# EAGLE design LC4032V-CPLDbreakout-v1 (EAGLE 5.11)
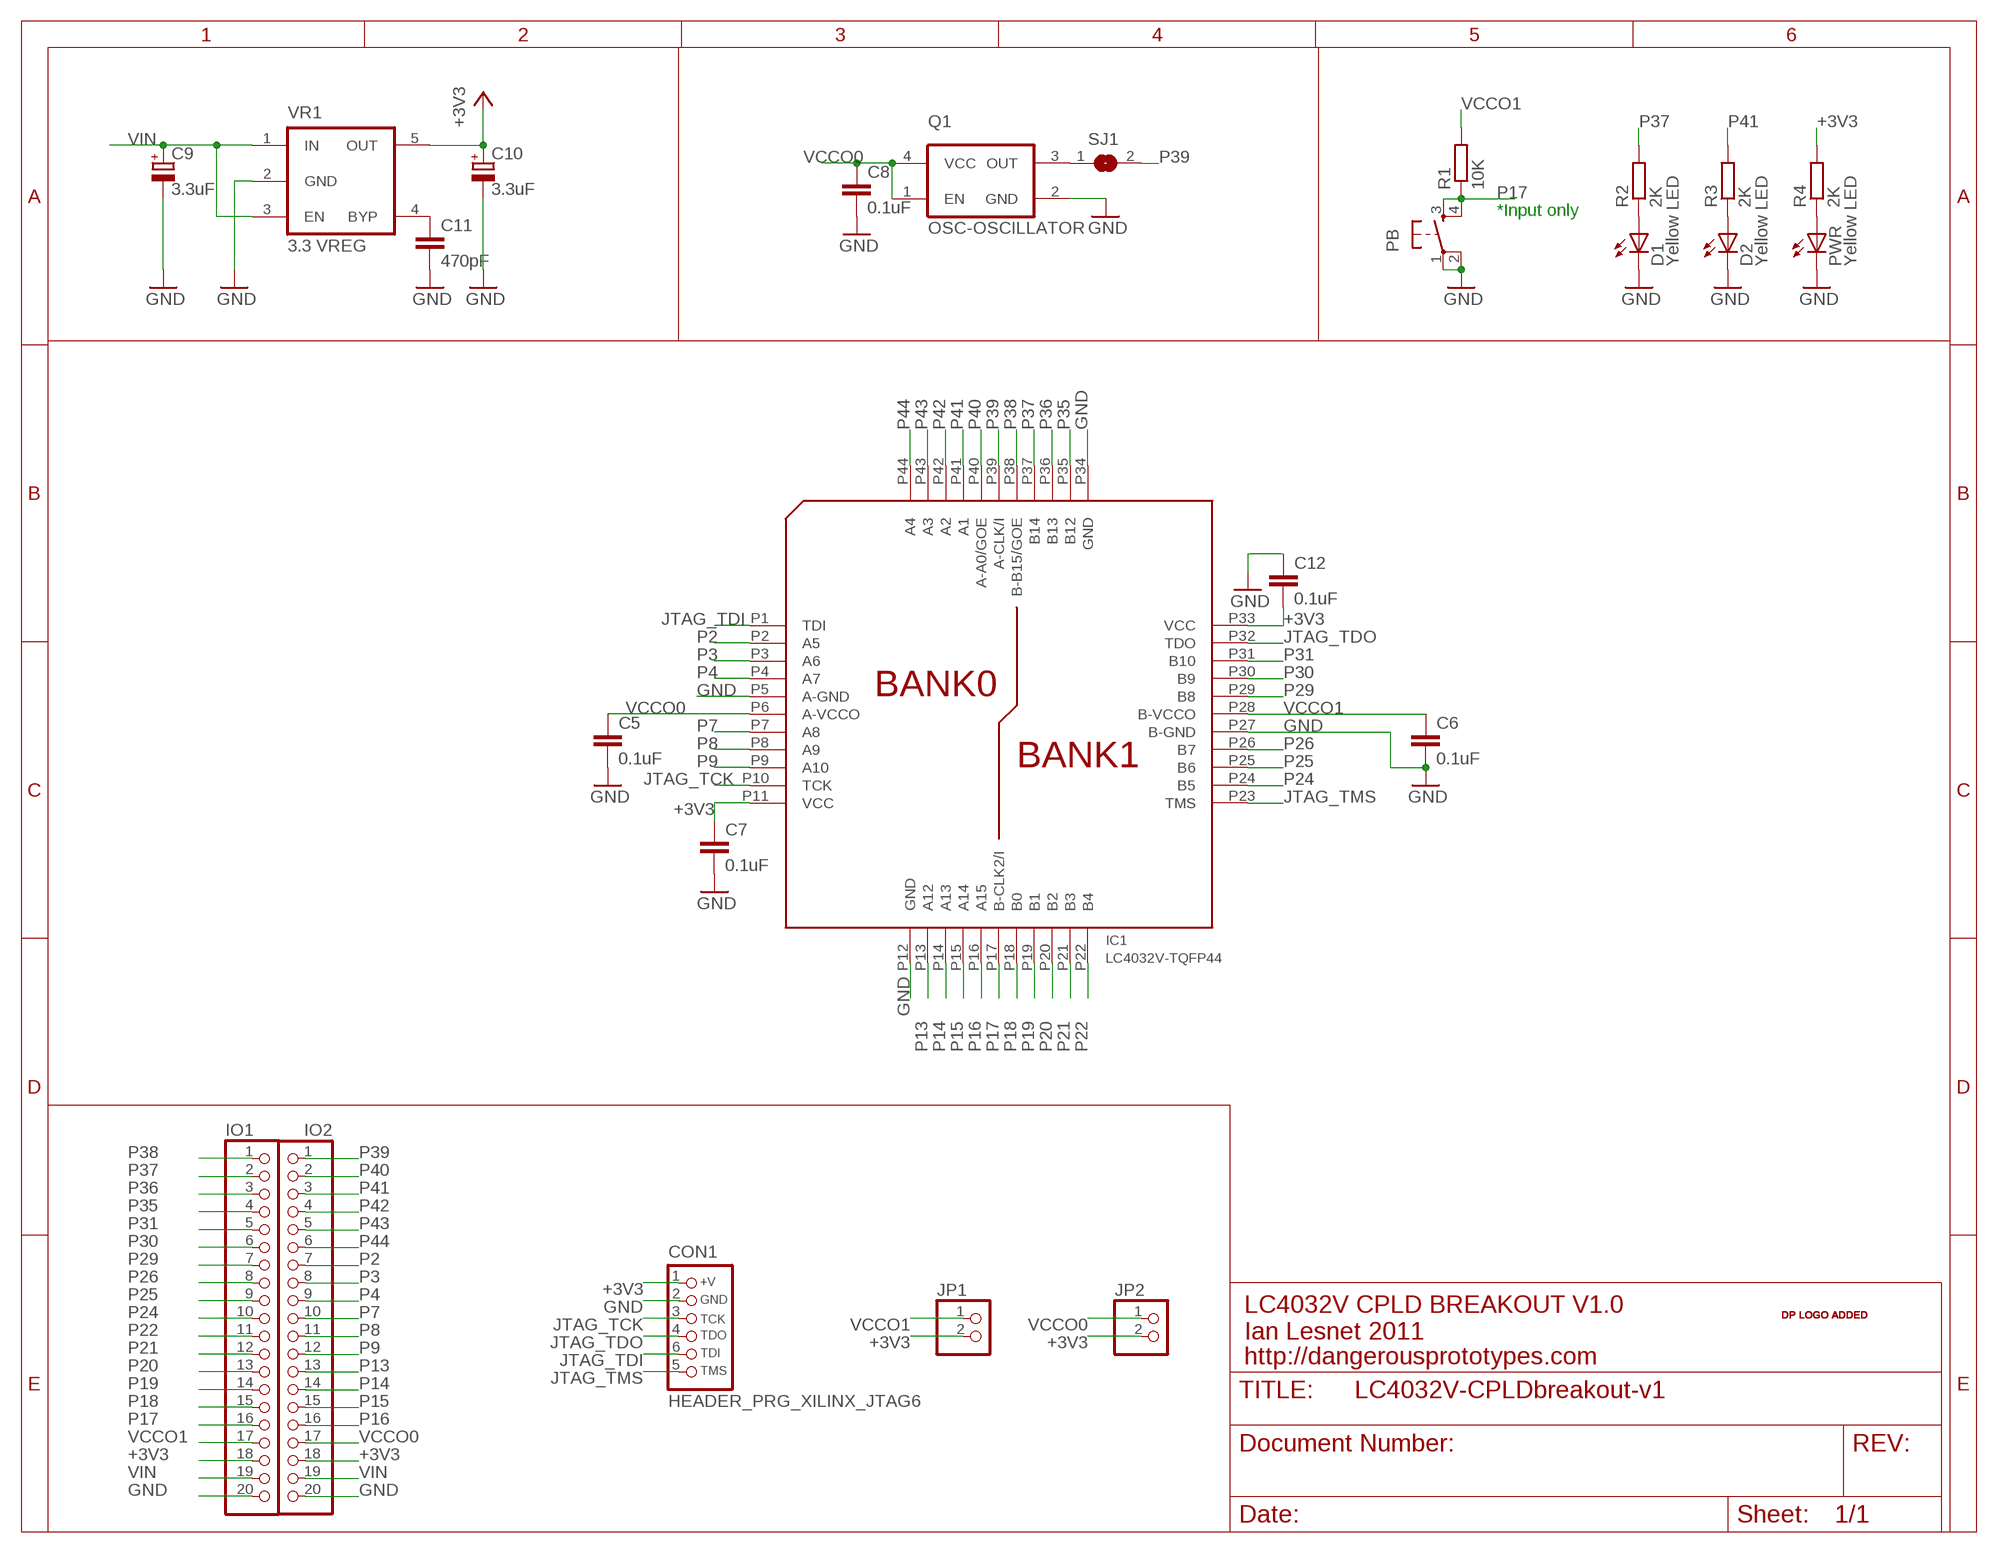
[diagram p0: schematic, sheet 1]

## Parts
C5  0.1uF  CAPC603  [C603]
C6  0.1uF  CAPC603  [C603]
C7  0.1uF  CAPC603  [C603]
C8  0.1uF  CAPC603  [C603]
C9  3.3uF  CAP_POLSMC_A  [SMC_A]
C10  3.3uF  CAP_POLSMC_A  [SMC_A]
C11  470pF  CAPC603  [C603]
C12  0.1uF  CAPC603  [C603]
CON1  HEADER_PRG_XILINX_JTAG6  [HEADER_PRG_1X06]
D1  Yellow LED  LED805  [LED-805]
D2  Yellow LED  LED805  [LED-805]
IC1  LC4032V-TQFP44  [TQFP44]
IO1  PINHD-1X20  [1X20]
IO2  PINHD-1X20  [1X20]
JP1  PINHD-1X02_2.54-S  [1X02-S]
JP2  PINHD-1X02_2.54-S  [1X02-S]
PB  SMD button small  SMD_TACT_SMALL  [TACT_SWITCH_SMALL]
PWR  Yellow LED  LED805  [LED-805]
Q1  OSC-OSCILLATOR  [OSCILLATOR_7X5_SMD]
R1  10K  RESISTORR603  [R603]
R2  2K  RESISTORR603  [R603]
R3  2K  RESISTORR603  [R603]
R4  2K  RESISTORR603  [R603]
SJ1  SJ  [SJ]
U$1  DP_LOGO  [DP_LOGO]
VR1  3.3 VREG  MIC5205  [SOT-23-5]

## Nets
+3V3: C7.1 C10.+ C12.2 CON1.1(+V) IC1.P11(VCC) IC1.P33(VCC) IO1.18 IO2.18 JP1.2 JP2.2 R4.2 VR1.5(OUT)
GND: C5.2 C6.2 C7.2 C8.2 C9.- C10.- C11.2 C12.1 CON1.2(GND) D1.C D2.C IC1.P5(A-GND) IC1.P12(GND) IC1.P27(B-GND) IC1.P34(GND) IO1.20 IO2.20 PB.1 PB.2 PWR.C Q1.2(GND) VR1.2(GND)
JTAG_TCK: CON1.3(TCK) IC1.P10(TCK)
JTAG_TDI: CON1.6(TDI) IC1.P1(TDI)
JTAG_TDO: CON1.4(TDO) IC1.P32(TDO)
JTAG_TMS: CON1.5(TMS) IC1.P23(TMS)
N$1: D1.A R2.1
N$2: D2.A R3.1
N$3: PWR.A R4.1
N$5: Q1.3(OUT) SJ1.1
N$7: C11.1 VR1.4(BYP)
P2: IC1.P2(A5) IO2.7
P3: IC1.P3(A6) IO2.8
P4: IC1.P4(A7) IO2.9
P7: IC1.P7(A8) IO2.10
P8: IC1.P8(A9) IO2.11
P9: IC1.P9(A10) IO2.12
P13: IC1.P13(A12) IO2.13
P14: IC1.P14(A13) IO2.14
P15: IC1.P15(A14) IO2.15
P16: IC1.P16(A15) IO2.16
P17: IC1.P17(B-CLK2/I) IO1.16 PB.3 PB.4 R1.1
P18: IC1.P18(B0) IO1.15
P19: IC1.P19(B1) IO1.14
P20: IC1.P20(B2) IO1.13
P21: IC1.P21(B3) IO1.12
P22: IC1.P22(B4) IO1.11
P24: IC1.P24(B5) IO1.10
P25: IC1.P25(B6) IO1.9
P26: IC1.P26(B7) IO1.8
P29: IC1.P29(B8) IO1.7
P30: IC1.P30(B9) IO1.6
P31: IC1.P31(B10) IO1.5
P35: IC1.P35(B12) IO1.4
P36: IC1.P36(B13) IO1.3
P37: IC1.P37(B14) IO1.2 R2.2
P38: IC1.P38(B-B15/GOE) IO1.1
P39: IC1.P39(A-CLK/I) IO2.1 SJ1.2
P40: IC1.P40(A-A0/GOE) IO2.2
P41: IC1.P41(A1) IO2.3 R3.2
P42: IC1.P42(A2) IO2.4
P43: IC1.P43(A3) IO2.5
P44: IC1.P44(A4) IO2.6
VCCO0: C5.1 C8.1 IC1.P6(A-VCCO) IO2.17 JP2.1 Q1.1(EN) Q1.4(VCC)
VCCO1: C6.1 IC1.P28(B-VCCO) IO1.17 JP1.1 R1.2
VIN: C9.+ IO1.19 IO2.19 VR1.1(IN) VR1.3(EN)

## Notes on the sheet
- *Input only
- LC4032V CPLD BREAKOUT V1.0
- Ian Lesnet 2011
- http://dangerousprototypes.com

## Library data of the parts
C5-C8 C11 C12 = dp_devices:CAP
C9 C10 = dp_devices:CAP_POL
CON1 = dp_devices:HEADER_PRG_XILINX_JTAG6: 6-pin Xilinx JTAG programming header
D1 D2 PWR = dp_devices:LED
IC1 = dp_devices:LC4032V: 32 Macrocells 3.3V CPLD
IO1 IO2 = pinhead:PINHD-1X20: PIN HEADER
JP1 JP2 = pinhead-2:PINHD-1X02: PIN HEADER
PB = dp_devices:SMD_TACT_SMALL
Q1 = dp_devices:OSC-OSCILLATOR: Oscillator
R1-R4 = dp_devices:RESISTOR
SJ1 = jumper:SJ: SMD solder JUMPER
U$1 = dp_devices:DP_LOGO; FF1: fullfillment by; FF2: Seeed studio; FF3: www.seeedstudio.com; LICENSE: CC-BY-SA; PROJECT: project; URL1: http://; URL2: DangerousPrototypes.com
VR1 = dp_devices:MIC5205: 150ma Low-Noise LDO Regulator

## Board
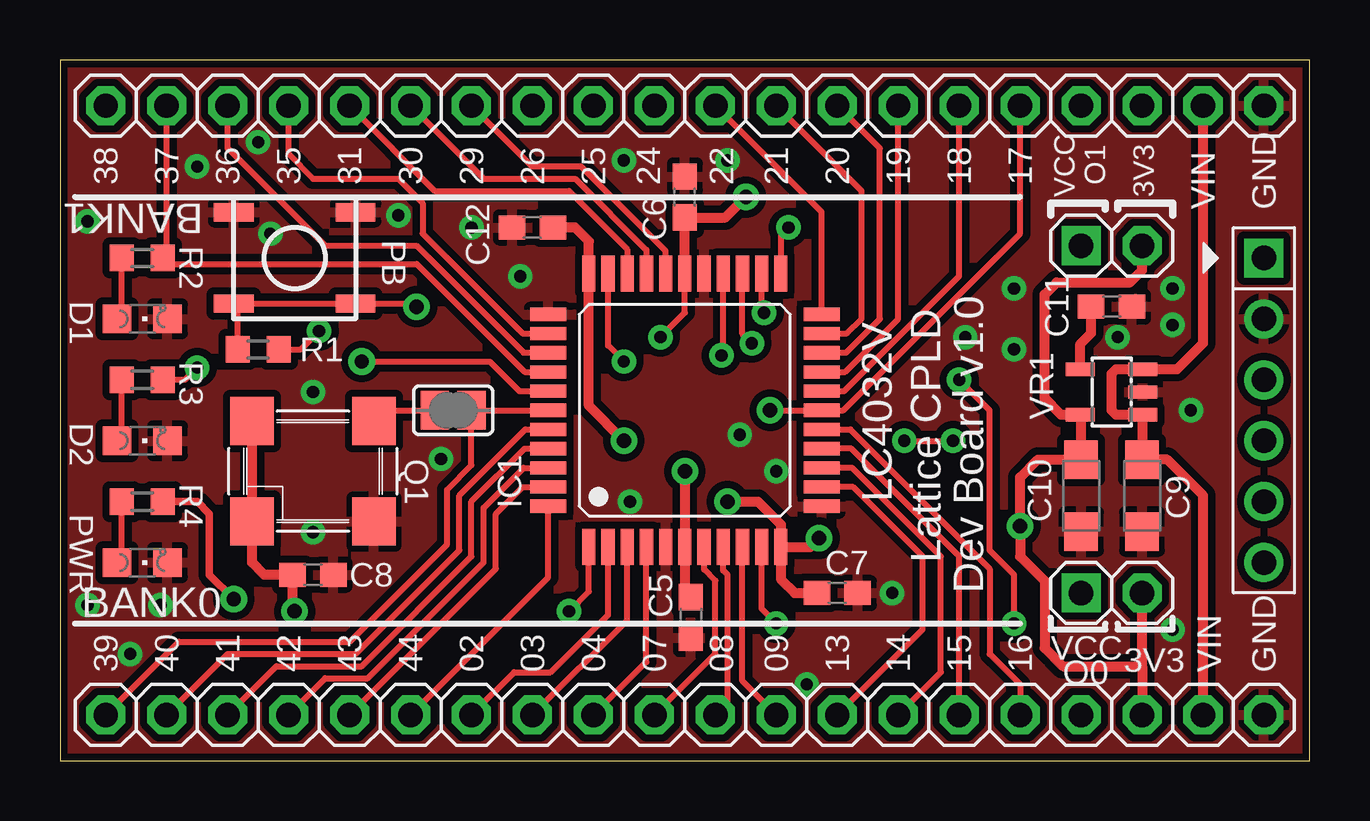
[diagram p1: board, top side]
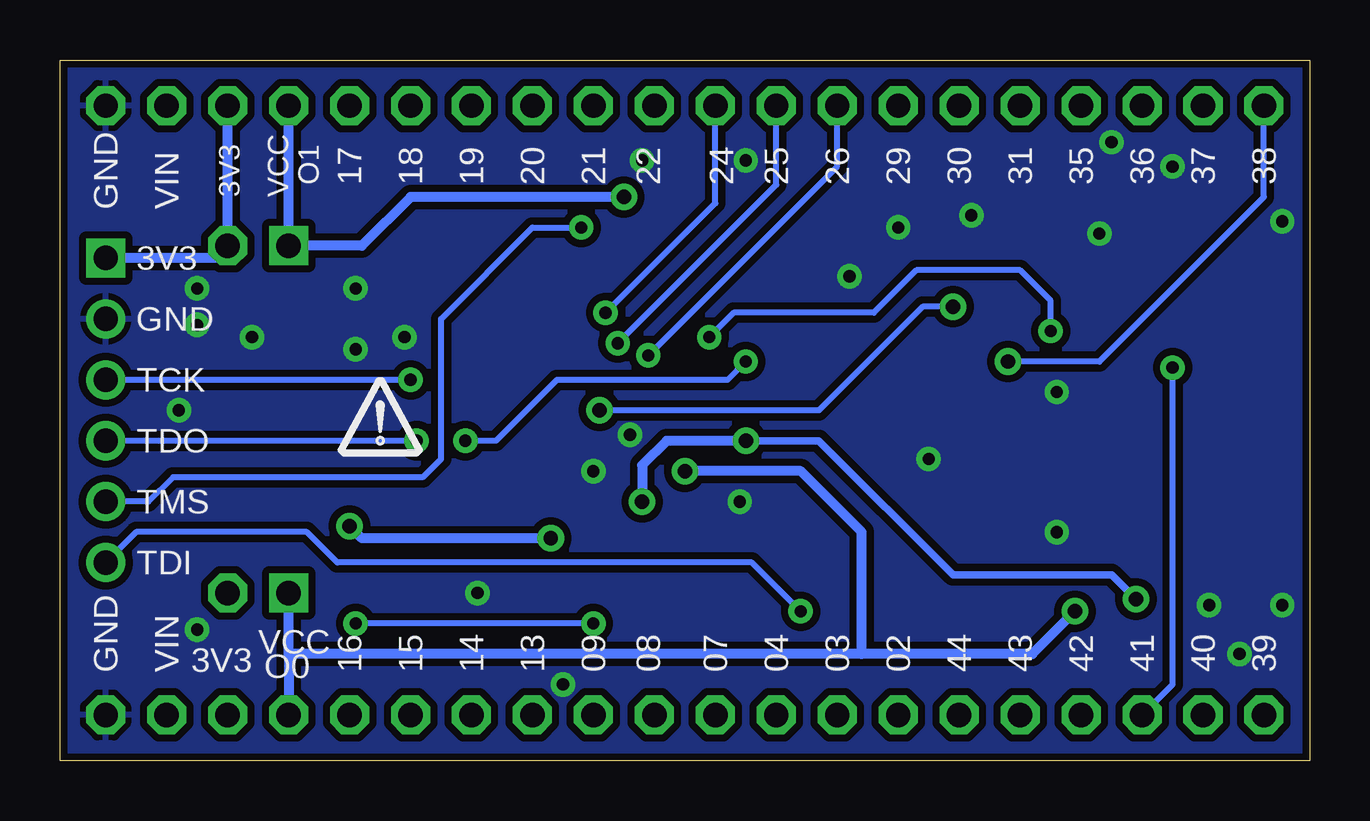
[diagram p2: board, bottom side, seen from below]

Size 52.07 x 29.21 mm. Coordinates in mm from the lower left corner, seen from the top.
Outline: 0,0 52.07,0 52.07,29.21 0,29.21 0,0
Copper layers (1*16): Top 0.035mm / dielectric 1.5mm / Bottom 0.035mm
Design rules "SparkFun": minimum track width 8mil, minimum drill 20mil, track to track 8mil, track to pad 8mil, pad to pad 8mil, via to via 8mil, smd to smd 8mil, copper to edge 10mil, drill to drill 8mil, minimum pad ring 12mil, minimum via ring 10mil, stop-mask expansion 4mil, vias tented up to drill 25mil, thermal gap 10mil

### Footprints (pad centres in the part's own frame; a part is rotated, then mirrored left to right if it is on the bottom)
C603 = smd 1.1 x 1: 1 -0.85,0; 2 0.85,0
SMC_A = smd 1.6 x 1.4: + -1.5,0; - 1.5,0
HEADER_PRG_1X06 = drill 1.016 square: 1 -6.35,0 | drill 1.016 round: 2 -3.81,0; 3 -1.27,0; 4 1.27,0; 5 3.81,0; 6 6.35,0
LED-805 = smd 1.2 x 1.2: A 0,-1.05; C 0,1.05
TQFP44 = smd 0.55 x 1.5: P1 -4,-5.7; P2 -3.2,-5.7; P3 -2.4,-5.7; P4 -1.6,-5.7; P5 -0.8,-5.7; P6 0,-5.7; P7 0.8,-5.7; P8 1.6,-5.7; P9 2.4,-5.7; P10 3.2,-5.7; P11 4,-5.7; P23 4,5.7; P24 3.2,5.7; P25 2.4,5.7; P26 1.6,5.7; P27 0.8,5.7; P28 0,5.7; P29 -0.8,5.7; P30 -1.6,5.7; P31 -2.4,5.7; P32 -3.2,5.7; P33 -4,5.7 | smd 1.5 x 0.55: P12 5.7,-4; P13 5.7,-3.2; P14 5.7,-2.4; P15 5.7,-1.6; P16 5.7,-0.8; P17 5.7,0; P18 5.7,0.8; P19 5.7,1.6; P20 5.7,2.4; P21 5.7,3.2; P22 5.7,4; P34 -5.7,4; P35 -5.7,3.2; P36 -5.7,2.4; P37 -5.7,1.6; P38 -5.7,0.8; P39 -5.7,0; P40 -5.7,-0.8; P41 -5.7,-1.6; P42 -5.7,-2.4; P43 -5.7,-3.2; P44 -5.7,-4
1X20 = drill 1.016 octagon: 1 -24.13,0; 2 -21.59,0; 3 -19.05,0; 4 -16.51,0; 5 -13.97,0; 6 -11.43,0; 7 -8.89,0; 8 -6.35,0; 9 -3.81,0; 10 -1.27,0; 11 1.27,0; 12 3.81,0; 13 6.35,0; 14 8.89,0; 15 11.43,0; 16 13.97,0; 17 16.51,0; 18 19.05,0; 19 21.59,0; 20 24.13,0
1X02-S = drill 1.016 square: 1 -1.27,0 | drill 1.016 octagon: 2 1.27,0
TACT_SWITCH_SMALL = smd 1.651 x 0.762: 1 -2.54,1.905; 2 2.54,1.905; 3 -2.54,-1.905; 4 2.54,-1.905
OSCILLATOR_7X5_SMD = smd 1.8 x 2: 1 -2.54,-2.1; 2 2.54,-2.1; 3 2.54,2.1; 4 -2.54,2.1
R603 = smd 1 x 1.1: 1 -0.85,0; 2 0.85,0
SJ = smd 1.168 x 1.6: 1 -0.762,0; 2 0.762,0
SOT-23-5 = smd 0.55 x 1.2: 1 -0.95,-1.3; 2 0,-1.3; 3 0.95,-1.3; 4 0.95,1.3; 5 -0.95,1.3

### Placement (x,y rotation side)
C5  26.29,5.97 270 top
C6  26.04,23.49 90 top
C7  32.39,6.99 0 top
C8  10.54,7.75 0 top
C9  45.09,11.05 270 top
C10  42.55,11.05 270 top
C11  43.82,18.92 0 top
C12  19.68,22.22 0 top
CON1  50.16,14.61 270 top
D1  3.43,18.41 270 top
D2  3.43,13.34 270 top
IC1  26.04,14.61 0 top
IO1  26.04,27.3 0 top
IO2  26.04,1.91 0 top
JP1  43.82,21.46 0 top
JP2  43.82,6.99 0 top
PB  9.78,20.95 0 top
PWR  3.43,8.26 270 top
Q1  10.54,12.06 0 top
R1  8.26,17.14 0 top
R2  3.43,20.95 0 top
R3  3.43,15.88 0 top
R4  3.43,10.79 0 top
SJ1  16.38,14.61 0 top
U$1  38.73,13.34 0 bottom
VR1  43.82,15.37 90 top

### Tracks (layer width: path | path; a pad name or v marks a point on that pad's centre or on a via)
+3V3  (via drill 0.6)
  Top 0.305: R4.2 5.71,10.79 6.22,10.29 6.22,7.75 v7.24,6.73
  Top 0.406: C12.2 21.46,22.22 22.04,21.65 IC1.P33 22.04,14.79 v23.49,13.34 | IC1.P11 30.04,7.56 30.61,6.99 C7.1 | JP1.2 45.09,20.45 44.58,19.94 41.53,19.94 41.02,19.43 41.02,15.11 41.72,14.42 VR1.5 42.55,14.39 C10.+ 40.74,12.55 40.01,11.81 v40.01,9.78 40.01,8.51 41.02,7.49 41.02,4.7 41.78,3.94 45.09,3.94 | IC1.P11 31.26,8.9 v31.62,9.27 | IC1.P11 30.04,9.84 29.08,10.79 v27.81,10.79 | 45.09,3.94 IO2.18 | 45.09,3.94 JP2.2
  Bottom 0.305: v23.49,13.34 20.45,13.34 14.86,7.75 8.26,7.75 v7.24,6.73
  Bottom 0.406: CON1.1 45.59,20.95 JP1.2 IO1.18 | v31.62,9.27 39.5,9.27 v40.01,9.78 | v23.49,13.34 26.8,13.34 27.81,12.32 v27.81,10.79
GND  (via drill 0.51)
  other vias: 17.14,22.22 19.18,20.19 8.76,21.97 5.71,24.76 8.26,25.78 14.1,22.73 1.14,22.48 2.92,4.45 4.19,6.48 1.14,6.48 15.88,12.57 10.54,15.37 10.54,9.53 28.32,13.59 29.84,12.06 23.75,10.79 27.81,25.02 23.49,25.02 46.36,19.68 44.07,17.65 46.36,18.16 47.12,14.61 46.36,5.46 31.11,3.17 34.67,6.99 39.75,19.68 39.75,17.14 37.72,17.65
  pour Bottom (isolate 0.305): -0.64,-0.64 52.71,-0.64 52.71,29.84 -0.64,29.84
  pour Top (isolate 0.305): -0.64,-0.64 52.71,-0.64 52.71,29.84 -0.64,29.84
JTAG_TCK  (via drill 0.51)
  Top 0.254: v29.84,5.71 29.23,6.33 IC1.P10 | v37.47,15.88 38.73,14.61 38.73,8.76 39.75,7.75 v39.75,5.71
  Bottom 0.254: v37.47,15.88 CON1.3 | v29.84,5.71 v39.75,5.71
JTAG_TDI  (via drill 0.51)
  Top 0.254: IC1.P1 22.04,7.05 v21.21,6.22
  Bottom 0.254: v21.21,6.22 23.24,8.26 40.51,8.26 41.78,9.53 48.9,9.53 CON1.6
JTAG_TDO  (via drill 0.51)
  Top 0.254: v35.18,13.34 v37.21,13.34 | v23.49,16.64 22.83,17.3 IC1.P32
  Bottom 0.254: v37.21,13.34 CON1.4 | v35.18,13.34 33.91,13.34 31.37,15.88 24.26,15.88 v23.49,16.64
JTAG_TMS  (via drill 0.51)
  Top 0.254: v30.35,22.22 30.04,21.91 IC1.P23
  Bottom 0.254: v30.35,22.22 32.39,22.22 36.2,18.41 36.2,12.57 36.96,11.81 47.37,11.81 48.39,10.79 CON1.5
N$1
  Top 0.254: R2.1 2.58,18.61 D1.A
N$2
  Top 0.254: R3.1 2.58,13.54 D2.A
N$3
  Top 0.254: R4.1 2.58,8.46 PWR.A
N$5
  Top 0.254: SJ1.1 12.51,14.61 Q1.3
N$7
  Top 0.406: VR1.4 42.52,17.37 42.97,17.82 C11.1
P2
  Top 0.254: IC1.P2 22.83,6.07 20.45,3.68 18.92,3.68 IO2.7
P3
  Top 0.254: IC1.P3 23.63,5.86 IO2.8
P4
  Top 0.254: IC1.P4 24.43,4.12 IO2.9
P7
  Top 0.254: IC1.P7 26.83,7.96 27.3,7.49 27.3,4.45 IO2.10
P8
  Top 0.254: 27.63,2.24 IO2.11 27.81,2.41 27.81,7.75 27.63,7.93 IC1.P8
P9
  Top 0.254: IC1.P9 28.43,3.32 IO2.12
P13
  Top 0.254: IC1.P13 33.05,11.4 35.94,8.51 35.94,5.46 IO2.13
P14
  Top 0.254: IC1.P14 33.01,12.21 36.7,8.51 36.7,3.68 IO2.14
P15
  Top 0.254: IC1.P15 32.97,13.01 37.47,8.51 IO2.15
P16
  Top 0.254: IC1.P16 32.93,13.8 38.73,8 38.73,4.45 40.01,3.17 IO2.16
P17  (via drill 0.6)
  Top 0.254: PB.3 PB.4 14.73,19.05 v14.86,18.92 | v29.59,14.61 IC1.P17 32.64,14.61 40.01,21.97 IO1.16 | PB.3 7.24,18.8 | R1.1 7.4,18.63 PB.3
  Bottom 0.254: v29.59,14.61 20.45,14.61 16.13,18.92 v14.86,18.92
P18
  Top 0.254: IC1.P18 32.68,15.4 37.47,20.19 IO1.15
P19
  Top 0.254: IC1.P19 32.72,16.2 34.93,18.41 IO1.14
P20
  Top 0.254: IC1.P20 32.75,17 34.16,18.41 34.16,25.53 IO1.13
P21
  Top 0.254: IC1.P21 32.79,17.8 33.4,18.41 33.4,23.75 IO1.12
P22
  Top 0.254: IC1.P22 31.73,22.88 IO1.11
P24  (via drill 0.51)
  Top 0.254: IC1.P24 29.23,18.77 v29.34,18.67
  Bottom 0.254: IO1.10 24.76,23.24 v29.34,18.67
P25  (via drill 0.51)
  Top 0.254: IC1.P25 28.43,17.79 v28.83,17.4
  Bottom 0.254: v28.83,17.4 22.22,24 IO1.9
P26  (via drill 0.51)
  Top 0.254: IC1.P26 27.63,17.07 v27.56,16.89
  Bottom 0.254: IO1.8 19.68,24.76 v27.56,16.89
P29
  Top 0.254: IC1.P29 25.23,21.25 21.72,24.76 19.68,24.76 IO1.7
P30
  Top 0.254: IC1.P30 24.43,21.29 21.46,24.26 17.65,24.26 IO1.6
P31
  Top 0.254: IC1.P31 23.63,21.32 21.21,23.75 15.62,23.75 IO1.5
P35
  Top 0.254: IC1.P35 19.28,17.8 15.11,21.97 15.11,23.24 14.1,24.26 10.54,24.26 9.53,25.27 IO1.4
P36
  Top 0.254: IC1.P36 19.32,17 14.86,21.46 11.05,21.46 6.99,25.53 IO1.3
P37
  Top 0.254: IO1.2 4.45,21.21 4.28,21.04 R2.2 4.28,20.7 14.86,20.7 19.35,16.2 IC1.P37
P38  (via drill 0.6)
  Top 0.254: IC1.P38 19.14,15.4 17.91,16.64 v12.57,16.64
  Bottom 0.254: v12.57,16.64 8.76,16.64 1.91,23.49 IO1.1
P39
  Top 0.254: IC1.P39 SJ1.2 17.14,12.32 16.13,11.3 16.13,9.02 12.06,4.95 4.95,4.95 IO2.1
P40
  Top 0.254: IC1.P40 19.39,13.8 16.64,11.05 16.64,8.76 12.32,4.45 6.99,4.45 IO2.2
P41  (via drill 0.51)
  Top 0.254: IC1.P41 19.35,13.01 17.14,10.79 17.14,8.51 12.57,3.94 9.02,3.94 IO2.3 | R3.2 5.21,15.88 v5.71,16.38
  Bottom 0.254: v5.71,16.38 5.71,3.17 IO2.3
P42
  Top 0.254: IC1.P42 19.32,12.21 17.65,10.54 17.65,8.26 12.83,3.43 11.05,3.43 IO2.4
P43
  Top 0.254: IC1.P43 19.28,11.4 18.16,10.29 18.16,8 IO2.5
P44
  Top 0.254: IC1.P44 20.33,7.63 IO2.6
VCCO0  (via drill 0.6)
  Top 0.406: C5.1 26.04,7.07 IC1.P6 v26.04,12.06 | Q1.4 Q1.1 8,8.26 8.51,7.75 C8.1 9.69,6.31 v9.78,6.22
  Bottom 0.406: 18.67,4.45 11.56,4.45 v9.78,6.22 | v26.04,12.06 21.21,12.06 18.67,9.53 18.67,4.45 | 42.55,4.45 IO2.17 | 42.55,4.45 JP2.1 | 18.67,4.45 42.55,4.45
VCCO1  (via drill 0.51, 0.6)
  Top 0.254: IC1.P28 26.04,18.67 v25.02,17.65 | R1.2 10.03,17.14 v10.79,17.91
  Top 0.406: IC1.P28 C6.1 27.72,22.64 v28.57,23.49
  Bottom 0.254: v25.02,17.65 24,18.67 18.16,18.67 16.38,20.45 12.06,20.45 10.79,19.18 v10.79,17.91
  Bottom 0.406: v28.57,23.49 37.47,23.49 39.5,21.46 JP1.1 IO1.17
VIN
  Top 0.406: IO1.19 47.62,17.4 46.54,16.32 VR1.3 44,16.32 43.82,16.13 43.82,14.61 44,14.42 VR1.1 45.12,12.33 C9.+ 46.12,12.55 47.62,11.05 IO2.19

### Text on the board
tNames: 38 | 37 | 36 | 35 | 31 | 30 | 29 | 26 | 25 | 24 | 22 | 21 | 20 | 19 | 18 | 17 | O1 | BANK1 | VCC | 3V3 | VIN | GND | LC4032V | Lattice CPLD | Dev Board v1.0 | BANK0 | VCC | 3V3 | 39 | 40 | 41 | 42 | 43 | 44 | 02 | 03 | 04 | 07 | 08 | 09 | 13 | 14 | 15 | 16 | O0 | VIN | GND
bNames: 38 | 37 | 36 | 35 | 31 | 30 | 29 | 26 | 25 | 24 | 22 | 21 | 20 | 19 | 18 | 17 | O1 | VCC | 3V3 | VIN | GND | 3V3 | GND | TCK | TDO | TMS | TDI | VCC | 39 | 40 | 41 | 42 | 43 | 44 | 02 | 03 | 04 | 07 | 08 | 09 | 13 | 14 | 15 | 16 | O0 | 3V3 | VIN | GND